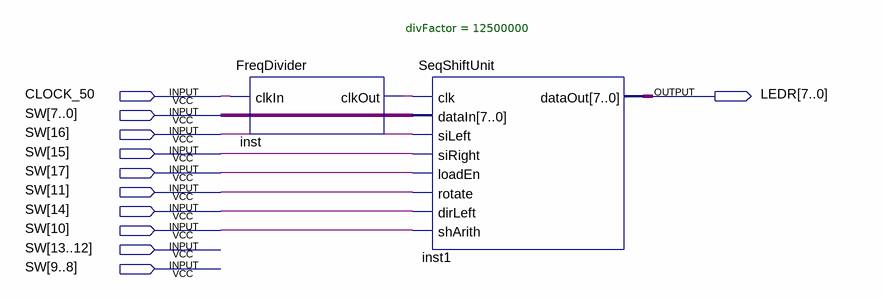
[diagram p0: schematic sheet]
// Quartus schematic SeqShiftUnit_Demo.bdf as structural Verilog: 2 symbols, 11 pins
module SeqShiftUnit_Demo (
  input  CLOCK_50,
  input  [17:0] SW,
  output [7:0] LEDR
);

  wire inst_clkout;

  FreqDivider #(.divFactor(12500000)) inst (.clkIn(CLOCK_50), .clkOut(inst_clkout));
  SeqShiftUnit inst1 (
    .clk(inst_clkout), .dataIn(SW[7:0]), .siLeft(SW[16]), .siRight(SW[15]), .loadEn(SW[17]), .rotate(SW[11]),
    .dirLeft(SW[14]), .shArith(SW[10]), .dataOut(LEDR));
endmodule
